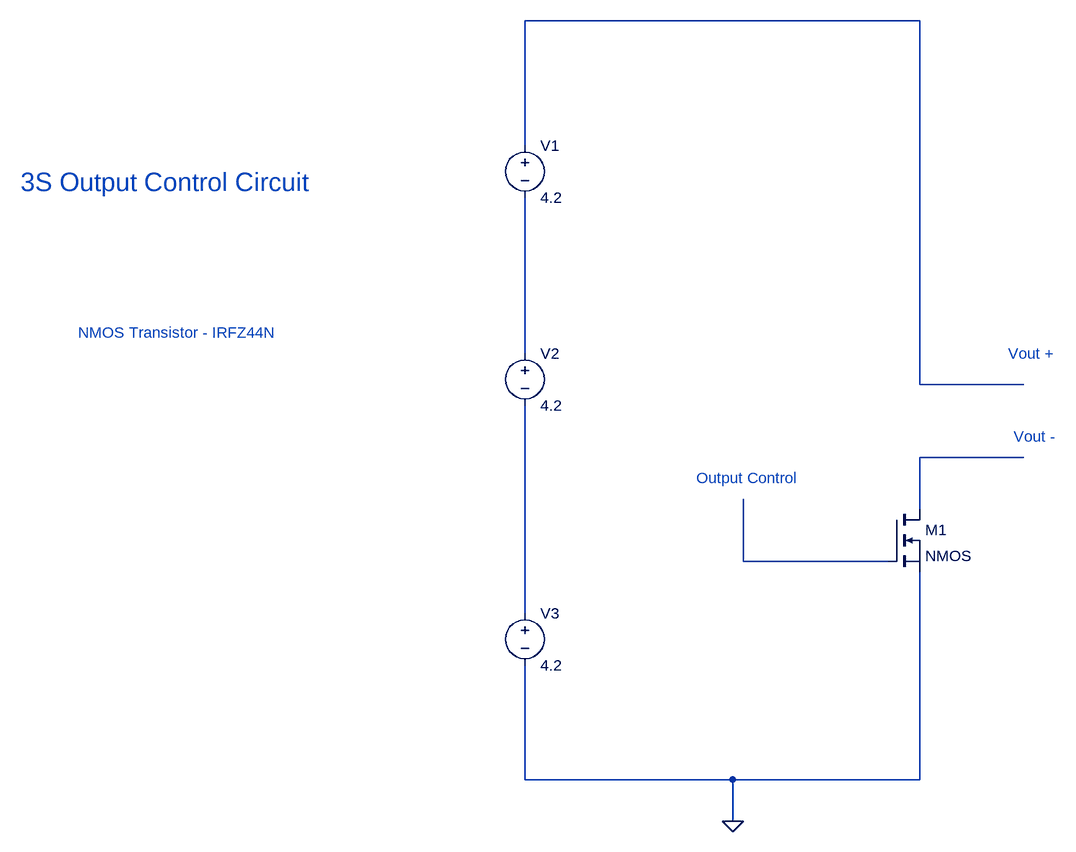
[diagram p0: schematic 3S Ouput Control circuit.asc]
3S Ouput Control circuit.asc, the LTspice schematic file:
Version 4
SHEET 1 1020 1108
WIRE 800 -144 192 -144
WIRE 192 48 192 -144
WIRE 192 368 192 128
WIRE 800 416 800 -144
WIRE 960 416 800 416
WIRE 960 528 800 528
WIRE 800 608 800 528
WIRE 528 688 528 592
WIRE 752 688 528 688
WIRE 192 768 192 448
WIRE 192 1024 192 848
WIRE 512 1024 192 1024
WIRE 800 1024 800 704
WIRE 800 1024 512 1024
WIRE 512 1088 512 1024
FLAG 512 1088 0
SYMBOL voltage 192 32 R0
WINDOW 123 0 0 Left 0
WINDOW 39 0 0 Left 0
SYMATTR InstName V1
SYMATTR Value 4.2
SYMBOL voltage 192 352 R0
WINDOW 123 0 0 Left 0
WINDOW 39 0 0 Left 0
SYMATTR InstName V2
SYMATTR Value 4.2
SYMBOL voltage 192 752 R0
WINDOW 123 0 0 Left 0
WINDOW 39 0 0 Left 0
SYMATTR InstName V3
SYMATTR Value 4.2
SYMBOL nmos 752 608 R0
SYMATTR InstName M1
TEXT 936 368 Left 2 ;Vout +
TEXT 944 496 Left 2 ;Vout -
TEXT 456 560 Left 2 ;Output Control
TEXT -584 104 Left 4 ;3S Output Control Circuit
TEXT -496 336 Left 2 ;NMOS Transistor - IRFZ44N

The netlist it stands for:
* 3S Ouput Control circuit.asc
V1 N001 N002 4.2
V2 N002 N005 4.2
V3 N005 0 4.2
M1 N003 N004 0 0 NMOS
.model NMOS NMOS
.model PMOS PMOS
.lib standard.mos
* Vout +
* Vout -
* Output Control
* 3S Output Control Circuit
* NMOS Transistor - IRFZ44N
.backanno
.end